# Altium project MY_FOC_2.PrjPcb
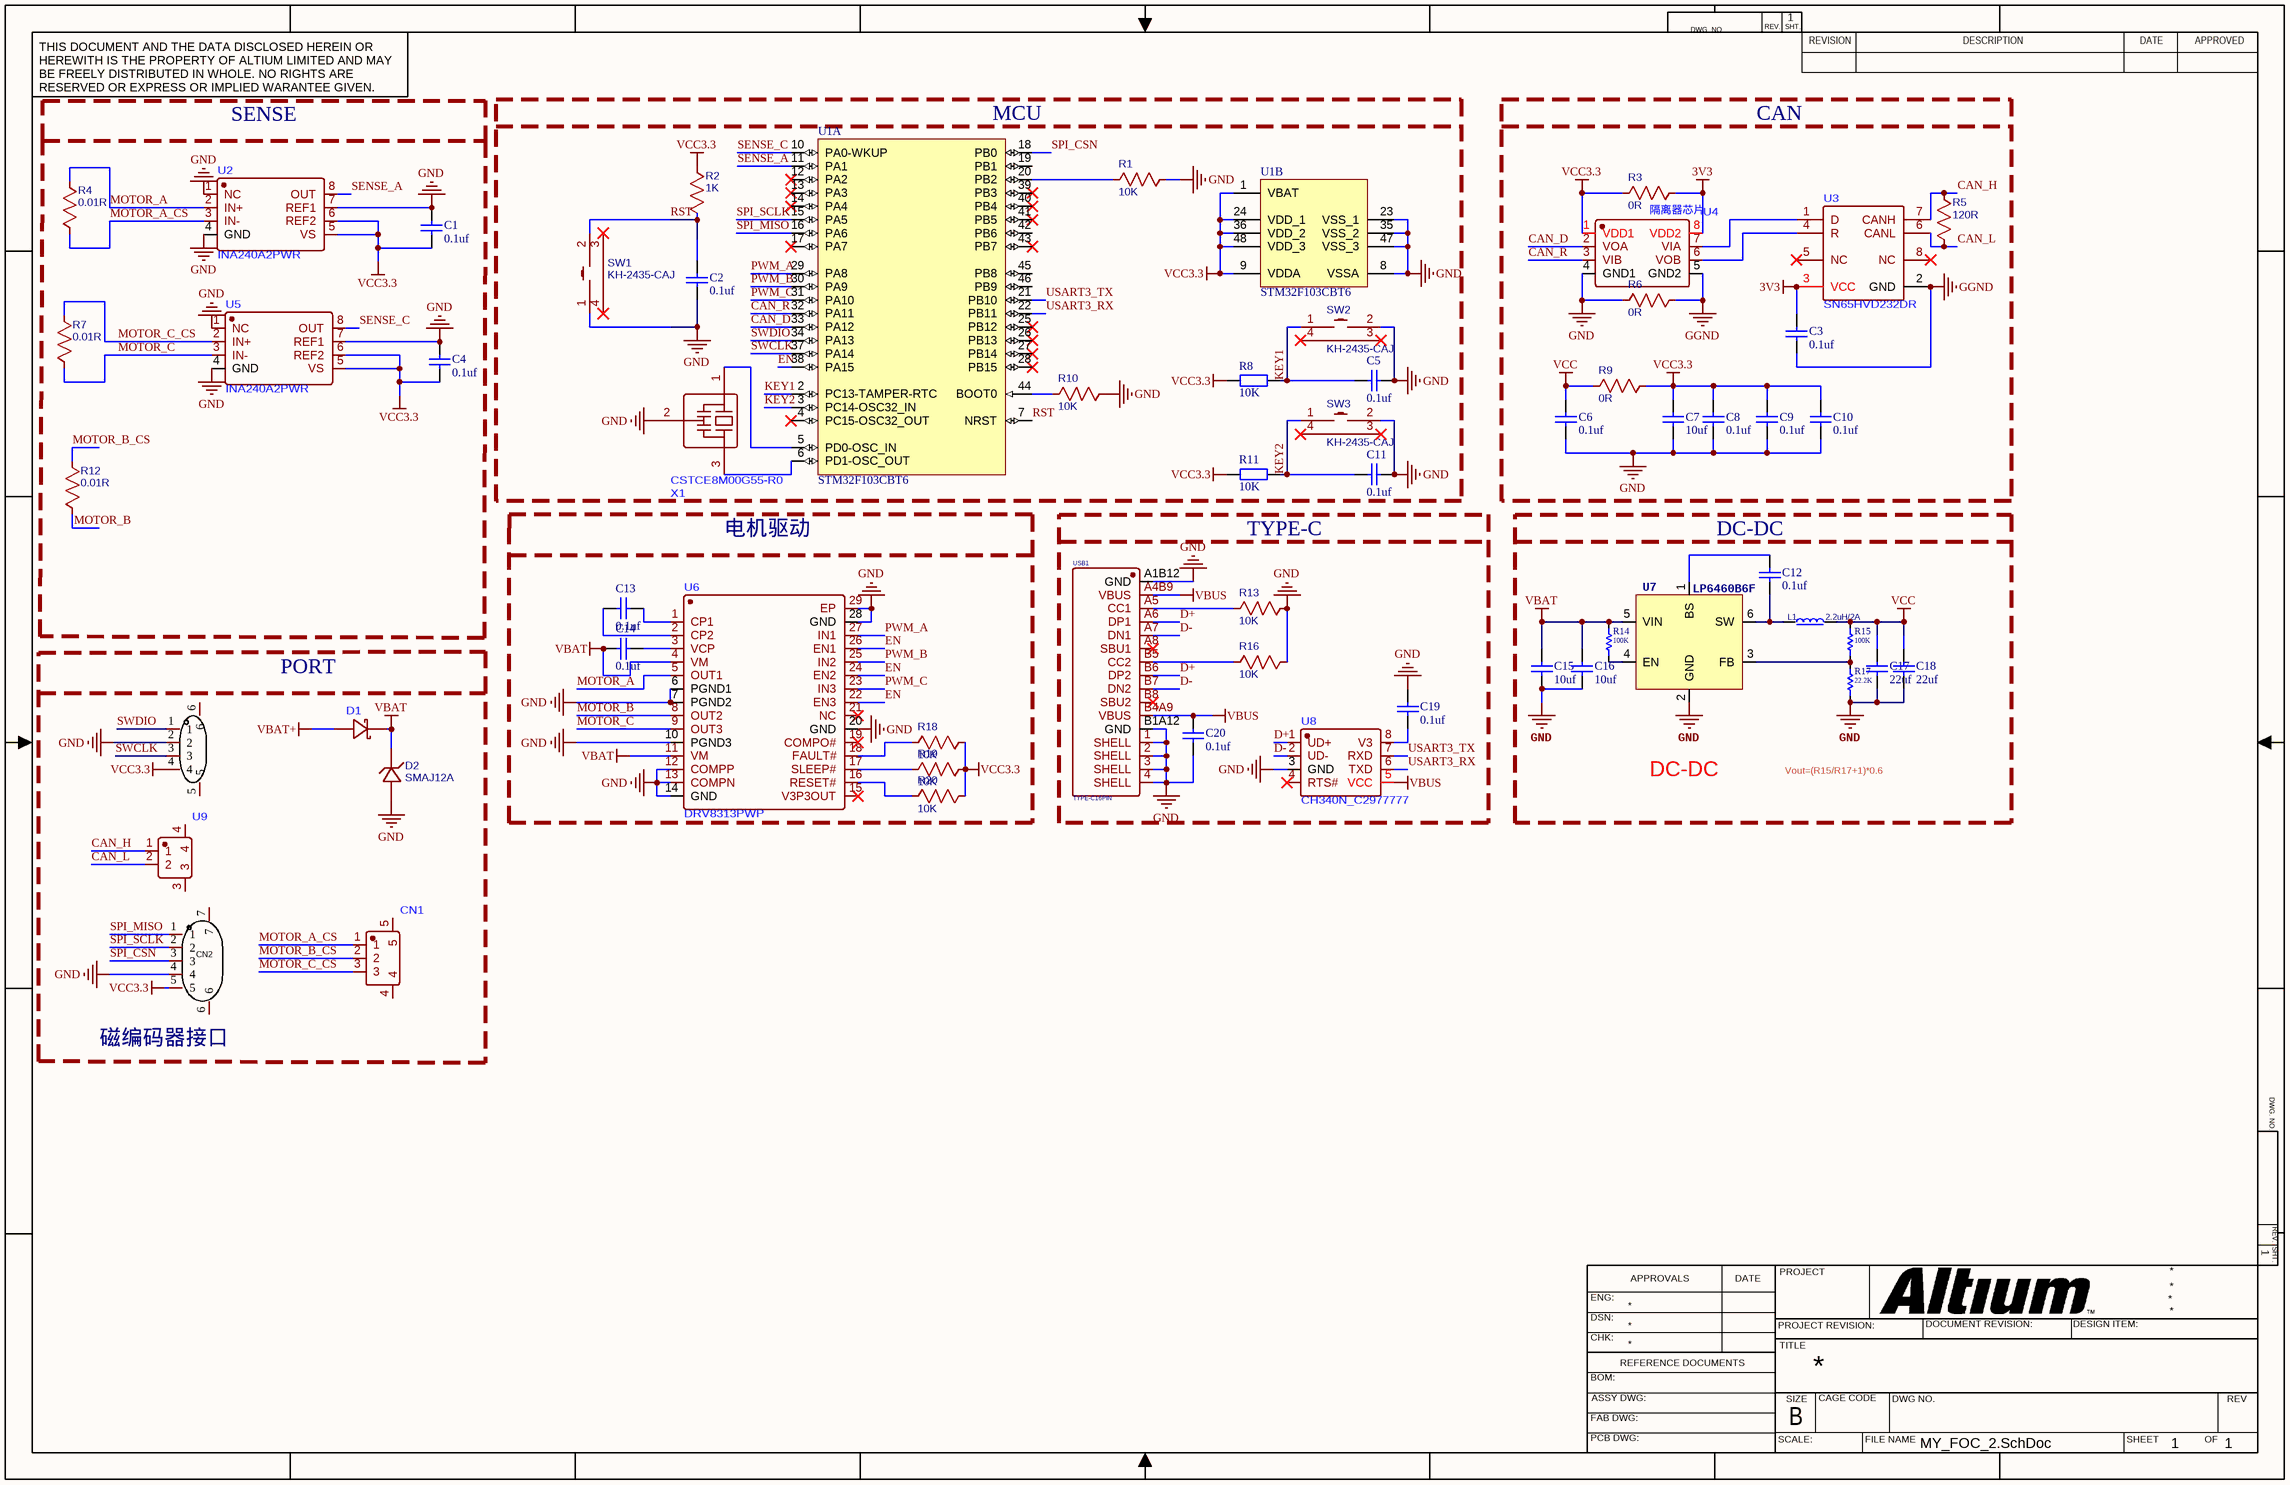
[diagram p0: MY_FOC_2.SchDoc]
1 sheet, 60 parts. Net scope: global (net labels, ports and power ports of the same name join across sheets).
Board file: MY_FOC_2.PcbDoc

## Sheet MY_FOC_2.SchDoc
size 431 x 279 mm; SheetNumber: 1; SheetTotal: 1

### Parts
C1  value 0.1uf  [CAP_0402]  (hidden comment: Cap)
C2  value 0.1uf  [CAP_0402]  (hidden comment: Cap)
C3  value 0.1uf  [CAP_0402]  (hidden comment: Cap)
C4  value 0.1uf  [CAP_0402]  (hidden comment: Cap)
C5  value 0.1uf  [CAP_0402]  (hidden comment: Cap)
C6  value 0.1uf  [CAP_0402]  (hidden comment: Cap)
C7  value 10uf  [CAP_0402]  (hidden comment: Cap)
C8  value 0.1uf  [CAP_0402]  (hidden comment: Cap)
C9  value 0.1uf  [CAP_0402]  (hidden comment: Cap)
C10  value 0.1uf  [CAP_0402]  (hidden comment: Cap)
C11  value 0.1uf  [CAP_0402]  (hidden comment: Cap)
C12  value 0.1uf  [CAP_0402]  (hidden comment: Cap)
C13  value 0.1uf  [CAP_0402]  (hidden comment: Cap)
C14  value 0.1uf  [CAP_0402]  (hidden comment: Cap)
C15  value 10uf  [CAP_0402]  (hidden comment: Cap)
C16  value 10uf  [CAP_0402]  (hidden comment: Cap)
C17  value 22uf  [CAP_0402]  (hidden comment: Cap)
C18  value 22uf  [CAP_0402]  (hidden comment: Cap)
C19  value 0.1uf  [CAP_0402]  (hidden comment: Cap)
C20  value 0.1uf  [CAP_0402]  (hidden comment: Cap)
CN1  (no value)  [SH1.0-3P-L]
CN2  HDGC1002WR-S-5P  [SH1.0-5P-L]  (value not drawn)
CN3  HDGC1002WR-S-4P  [SH1.0-4P-L]  (value not drawn)
D1  (no value)  [DO-214AC - duplicate]
D2  SMAJ12A  [SMA_L4.4-W2.8-LS5.4-RD]
L1  2.2uH/2A  [Inductor_CD_43]
R1  10K  [RES_0402]
R2  1K  [RES_0402]
R3  0R  [RES_0402]
R4  0.01R  [R1206]
R5  120R  [RES_0402]
R6  0R  [RES_0402]
R7  0.01R  [R1206]
R8  10K  [RES_0402]
R9  0R  [R1206]
R10  10K  [RES_0402]
R11  10K  [RES_0402]
R12  0.01R  [R1206]
R13  10K  [RES_0402]
R14  100K  [RES_0402]
R15  100K  [RES_0402]
R16  10K  [RES_0402]
R17  22.2K  [RES_0402]
R18  10K  [RES_0402]
R19  10K  [RES_0402]
R20  10K  [RES_0402]
SW1  KH-2435-CAJ  [SW-SMD_KH-2435-CAJ]
SW2  KH-2435-CAJ  [SW-SMD_KH-2435-CAJ]
SW3  KH-2435-CAJ  [SW-SMD_KH-2435-CAJ]
U1  STM32F103CBT6  [LQFP-48]  (parts A,B of 2)
U2  INA240A2PWR  [TSSOP-8_L4.4-W3.0-P0.65-LS6.4-BL]
U3  SN65HVD232DR  [SOIC-8_L5.0-W4.0-P1.27-LS6.0-BL]
U4  隔离器芯片  [SOIC-8_L4.9-W3.9-P1.27-LS6.0-BL]
U5  INA240A2PWR  [TSSOP-8_L4.4-W3.0-P0.65-LS6.4-BL]
U6  DRV8313PWP  [HTSSOP-28_L9.8-W4.5-P0.65-LS6.6-BL-EP]
U7  LP6460B6F  [SOT23_6]
U8  CH340N_C2977777  [SOP-8_L4.9-W3.9-P1.27-LS6.0-BL]
U9  (no value)  [SH1.0-2P-L]
USB1  TYPE-C16PIN  [USB-C-SMD_TYPE-C16PIN]
X1  CSTCE8M00G55-R0  [OSC-SMD_3P-L3.2-W1.3-P1.2-L]

### Blocks framed on the sheet
MCU: C2 C5 C11 R1 R2 R8 R10 R11 SW1-SW3 U1 X1
CAN: C3 C6-C10 R3 R5 R6 R9 U3 U4
SENSE: C1 C4 R4 R7 R12 U2 U5
电机驱动: C13 C14 R18-R20 U6
TYPE-C: C19 C20 R13 R16 U8 USB1

### Nets
3V3: C3.2 R3.2 U3.3(VCC) U4.8(VDD2)
GGND: C3.1 R6.2 U3.2(GND) U4.5(GND2)
GND: C1.2 C2.1 C4.2 C5.1 C6.1 C7.1 C8.1 C9.1 C10.1 C11.1 C15.2 C16.2 C17.2 C18.2 C19.1 C20.2 CN2.4 CN3.2 D2.2 R1.1 R6.1 R10.1 R13.1 R16.1 R17.2 SW1.1 SW2.2 SW3.2 U1.8(VSSA) U1.23(VSS_1) U1.35(VSS_2) U1.47(VSS_3) U2.1(NC) U2.4(GND) U2.7(REF1) U4.4(GND1) U5.1(NC) U5.4(GND) U5.7(REF1) U6.6(PGND1) U6.7(PGND2) U6.10(PGND3) U6.12(COMPP) U6.13(COMPN) U6.14(GND) U6.20(GND) U6.28(GND) U6.29(EP) U7.2(GND) U8.3(GND) USB1.1(SHELL) USB1.2(SHELL) USB1.3(SHELL) USB1.4(SHELL) USB1.A1B12(GND) USB1.B1A12(GND) X1.2(VSS)
VBAT: C14.2 C15.1 C16.1 D1.1(C) D2.1 R14.1 U6.4(VM) U6.11(VM) U7.5(VIN)
VBAT+: D1.2(A)
VBUS: C20.1 U8.5(VCC) USB1.A4B9(VBUS) USB1.B4A9(VBUS)
VCC: C6.2 C17.1 C18.1 L1.1 R9.1 R15.1
VCC3.3: C1.1 C4.1 C7.2 C8.2 C9.2 C10.2 CN2.5 CN3.4 R2.1 R3.1 R8.1 R9.2 R11.1 R18.1 R19.1 R20.1 U1.1(VBAT) U1.9(VDDA) U1.24(VDD_1) U1.36(VDD_2) U1.48(VDD_3) U2.5(VS) U2.6(REF2) U4.1(VDD1) U5.5(VS) U5.6(REF2)
CAN_D: U1.33(PA12) U4.2(VOA)
CAN_H: R5.1 U3.7(CANH) U9.1
CAN_L: R5.2 U3.6(CANL) U9.2
CAN_R: U1.32(PA11) U4.3(VIB)
D+: U8.1(UD+) USB1.A6(DP1) USB1.B6(DP2)
D-: U8.2(UD-) USB1.A7(DN1) USB1.B7(DN2)
EN: U1.38(PA15) U6.22(EN3) U6.24(EN2) U6.26(EN1)
KEY1: C5.2 R8.2 SW2.1 U1.2(PC13-TAMPER-RTC)
KEY2: C11.2 R11.2 SW3.1 U1.3(PC14-OSC32_IN)
MOTOR_A: R4.2 U2.2(IN+) U6.5(OUT1)
MOTOR_A_CS: CN1.1 R4.1 U2.3(IN-)
MOTOR_B: R12.1 U6.8(OUT2)
MOTOR_B_CS: CN1.2 R12.2
MOTOR_C: R7.1 U5.3(IN-) U6.9(OUT3)
MOTOR_C_CS: CN1.3 R7.2 U5.2(IN+)
PWM_A: U1.29(PA8) U6.27(IN1)
PWM_B: U1.30(PA9) U6.25(IN2)
PWM_C: U1.31(PA10) U6.23(IN3)
RST: C2.2 R2.2 SW1.2 U1.7(NRST)
SENSE_A: U1.11(PA1) U2.8(OUT)
SENSE_C: U1.10(PA0-WKUP) U5.8(OUT)
SPI_CSN: CN2.3 U1.18(PB0)
SPI_MISO: CN2.1 U1.16(PA6)
SPI_SCLK: CN2.2 U1.15(PA5)
SWCLK: CN3.3 U1.37(PA14)
SWDIO: CN3.1 U1.34(PA13)
USART3_RX: U1.22(PB11) U8.6(TXD)
USART3_TX: U1.21(PB10) U8.7(RXD)
NetC12_1: C12.1 U7.1(BS)
NetC12_2: C12.2 L1.2 U7.6(SW)
NetC13_1: C13.1 U6.1(CP1)
NetC13_2: C13.2 U6.2(CP2)
NetC14_1: C14.1 U6.3(VCP)
NetC19_2: C19.2 U8.8(V3)
NetR1_2: R1.2 U1.20(PB2)
NetR10_2: R10.2 U1.44(BOOT0)
NetR13_2: R13.2 USB1.A5(CC1)
NetR14_2: R14.2 U7.4(EN)
NetR15_2: R15.2 R17.1 U7.3(FB)
NetR16_2: R16.2 USB1.B5(CC2)
NetR18_2: R18.2 U6.18(FAULT#)
NetR19_2: R19.2 U6.17(SLEEP#)
NetR20_2: R20.2 U6.16(RESET#)
NetU1_5: U1.5(PD0-OSC_IN) X1.1
NetU1_6: U1.6(PD1-OSC_OUT) X1.3
NetU3_1: U3.1(D) U4.7(VIA)
NetU3_4: U3.4(R) U4.6(VOB)

Not connected (* = marked no-connect by the designer): CN1 4 5; CN2 6 7; CN3 5 6; SW1 3* 4*; SW2 3* 4*; SW3 3* 4*; U1 4(PC15-OSC32_OUT)* 12(PA2)* 13(PA3)* 14(PA4)* 17(PA7)* 19(PB1) 25(PB12)* 26(PB13)* 27(PB14)* 28(PB15)* 39(PB3)* 40(PB4)* 41(PB5)* 42(PB6) 43(PB7)* 45(PB8) 46(PB9); U3 5(NC)* 8(NC)*; U6 15(V3P3OUT)* 19(COMPO#)* 21(NC)*; U8 4(RTS#)*; U9 3 4; USB1 A8(SBU1)* B8(SBU2)*

### Notes on the sheet
- (near C12) DC-DC
- PORT
- DC-DC
- Vout=(R15/R17+1)*0.6
- (near CN2) 磁编码器接口
- DWG. NO.
- REV.
- SHT.
- THIS DOCUMENT AND THE DATA DISCLOSED HEREIN OR HEREWITH IS THE PROPERTY OF ALTIUM LIMITED AND MAY BE FREELY DISTRIBUTED IN WHOLE. NO RIGHTS ARE RESERVED OR EXPRESS OR IMPLIED WARANTEE GIVEN.
- REVISION
- DESCRIPTION
- DATE
- APPROVED
- ENG:
- APPROVALS
- PROJECT
- DSN:
- CHK:
- REFERENCE DOCUMENTS
- PROJECT REVISION:
- TITLE
- DOCUMENT REVISION:
- DESIGN ITEM:
- BOM:
- FAB DWG:
- PCB DWG:
- ASSY DWG:
- SCALE:
- SIZE
- B
- CAGE CODE
- FILE NAME
- DWG NO.
- SHEET
- OF
- REV

### Library data of the parts
C1-C20 = Cap: Capacitor; Published: 8-Jun-2000; LatestRevisionDate: 17-Jul-2002; LatestRevisionNote: Re-released for DXP Platform.; PackageReference: RAD-0.3; Publisher: Altium Limited; PackageDescription: Radial Cap, Thru-Hole; 2 Leads; 0.3 in Pin Spacing
CN1 = SH1.0-3P-L
CN2 = HDGC1002WR-S-5P: Manufacturer: HDGC(华德共创); Add into BOM: yes; Name: HDGC1002WR-S-5P; Symbol: HDGC1002WR-S-5P; Device: HDGC1002WR-S-5P; LCSC Part Name: SH1.0针座卧贴 5P; Supplier Part: C3041140; Manufacturer Part: HDGC1002WR-S-5P; Supplier Footprint: SMD,P=1mm; JLCPCB Part Class: Extended Part; Datasheet: https://atta.szlcsc.com/upload/public/pdf/source/20220621/C2AA6A1A2A279F73FC0521BA202CB6E2.pdf; Supplier: LCSC; Convert to PCB: yes
CN3 = HDGC1002WR-S-4P: Manufacturer: HDGC(华德共创); Add into BOM: yes; Name: HDGC1002WR-S-4P; Symbol: HDGC1002WR-S-4P; Device: HDGC1002WR-S-4P; LCSC Part Name: SH1.0针座卧贴 4P; Supplier Part: C2936214; Manufacturer Part: HDGC1002WR-S-4P; Supplier Footprint: SMD,P=1mm; JLCPCB Part Class: Extended Part; Datasheet: https://atta.szlcsc.com/upload/public/pdf/source/20211229/E8A09E85670B5E97244D2008A24D97FE.pdf; Supplier: LCSC; Convert to PCB: yes
D1 = SS54A
D2 = SMAJ12A: BOM_Manufacturer: Brightking Elec (TAIWAN); BOM_Manufacturer Part: SMAJ70A; Contributor: LCSC; BOM_Supplier: LCSC; BOM_Supplier Part: C309908; BOM_JLCPCB Part Class: Extended Part; spicePre: D; spiceSymbolName: SMAJ70A
L1 = PL4020: 贴片电感; Material name: 功率电感; Value: WPN4020H2R2MT; PCB DECAL: PL4020
R1-R7 R9 R10 R12 R13 R16 R18-R20 = 0R: nameAlias: Value(Ω); Contributor: LCEDA_Lib; spicePre: R; spiceSymbolName: R_0603_US
R8 R11 = R: 贴片电阻; 版权归属: 来自淘宝 ID：黄晶宝石; 封装库来自淘宝卖家 ID：黄晶宝石: 其他店铺购入均为盗版，不享受售后技术支持服务，请立即申请退款; BOM名称: 贴片电阻; 联系售后: https://shop463601444.taobao.com
R14 R15 R17 = 电阻-0402: 贴片电阻; Value: 22R
SW1-SW3 = KH-2435-CAJ: BOM_Manufacturer: HYP; BOM_Manufacturer Part: 1TS003B-1600-3500A; Contributor: LCSC; BOM_Supplier: LCSC; BOM_Supplier Part: C255808; BOM_JLCPCB Part Class: Extended Part; spicePre: S; spiceSymbolName: KH-2435-CAJ
U1 = STM32F103CBT6: ARM Cortex-M3 32-bit MCU, 128 KB Flash, 20 KB Internal RAM, 37 I/Os, 48-pin LQFP, -40 to 85 degC, Tray; A/D Converter: 2x12-bit (10 Channel); FLASH Size (Prog) (kB): 128; I/Os (High Current): 37; Internal RAM Size (kB): 20; Operating Frequency(F) (Processor speed) (MHz): 72; Supply Voltage(Vcc) min (V): 2; DatasheetVersion: Rev. 16; PackageVersion: Rev. 6, 06/2013; PackageReference: LQFP48; PackageDescription: 48-Pin Low Profile Quad Flat Package, 7 x 7 mm Body, 0.5 mm Pitch; Supplier 1: Digi-Key; Supplier Part Number 1: 497-6288-ND; Supplier 2: Farnell; Supplier Part Number 2: 1606327; Supplier 3: Newark; Supplier Part Number 3: 11N8296; Supplier 4: Newark; Supplier Part Number 4: 57P1214; Supplier 5: Mouser; Supplier Part Number 5: 511-STM32F103CBT6; Core: ARM Cortex-M3; Packing: Tray; Mounting Technology: Surface Mount; PartNumber: STM32F103CBT6; ComponentLink1Description: Manufacturer URL; ComponentLink1URL: http://www.st.com/web/en/home.html; ComponentLink2Description: Datasheet; ComponentLink2URL: http://www.st.com/st-web-ui/static/active/en/resource/technical/document/datasheet/CD00161566.pdf; ComponentLink3Description: Package Specification; ComponentLink3URL: http://www.st.com/st-web-ui/static/active/en/resource/technical/document/datasheet/DM00058181.pdf
U4 = [JLCSMT]-ADUM1201ARZ-RL7
U7 = LP6460B6F: DC-DC芯片
U9 = WAFER-SH1.0-2PWB
USB1 = TYPE-C16PIN: BOM_Manufacturer: SHOU HAN; Contributor: LCSC; BOM_Supplier: LCSC; BOM_Supplier Part: C393939; BOM_Manufacturer Part: TYPE-C16PIN; spicePre: U